# EAGLE board upperArm (EAGLE 9.6.2)
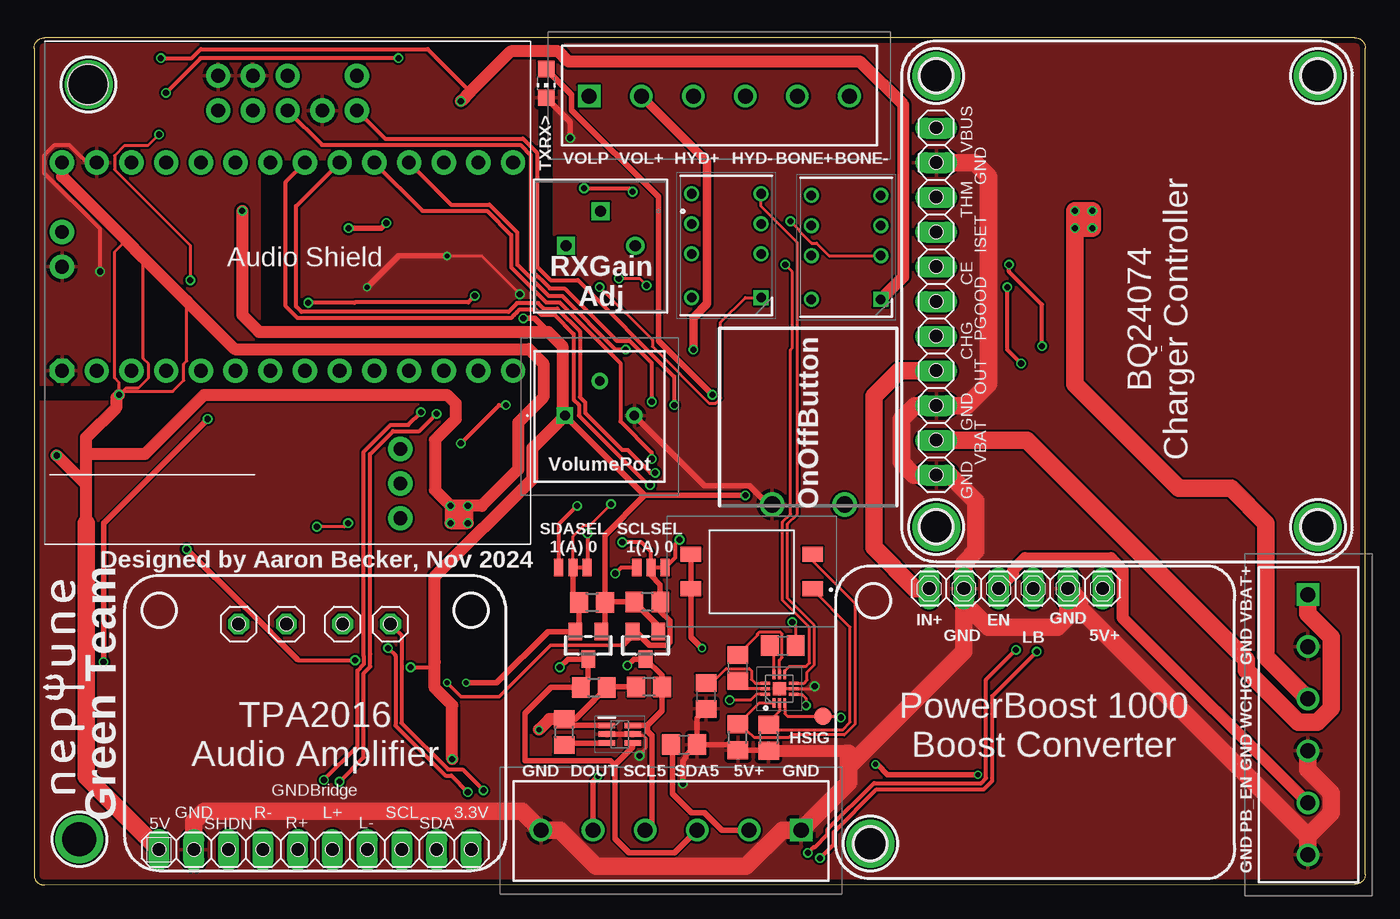
[diagram p5: board, top side]
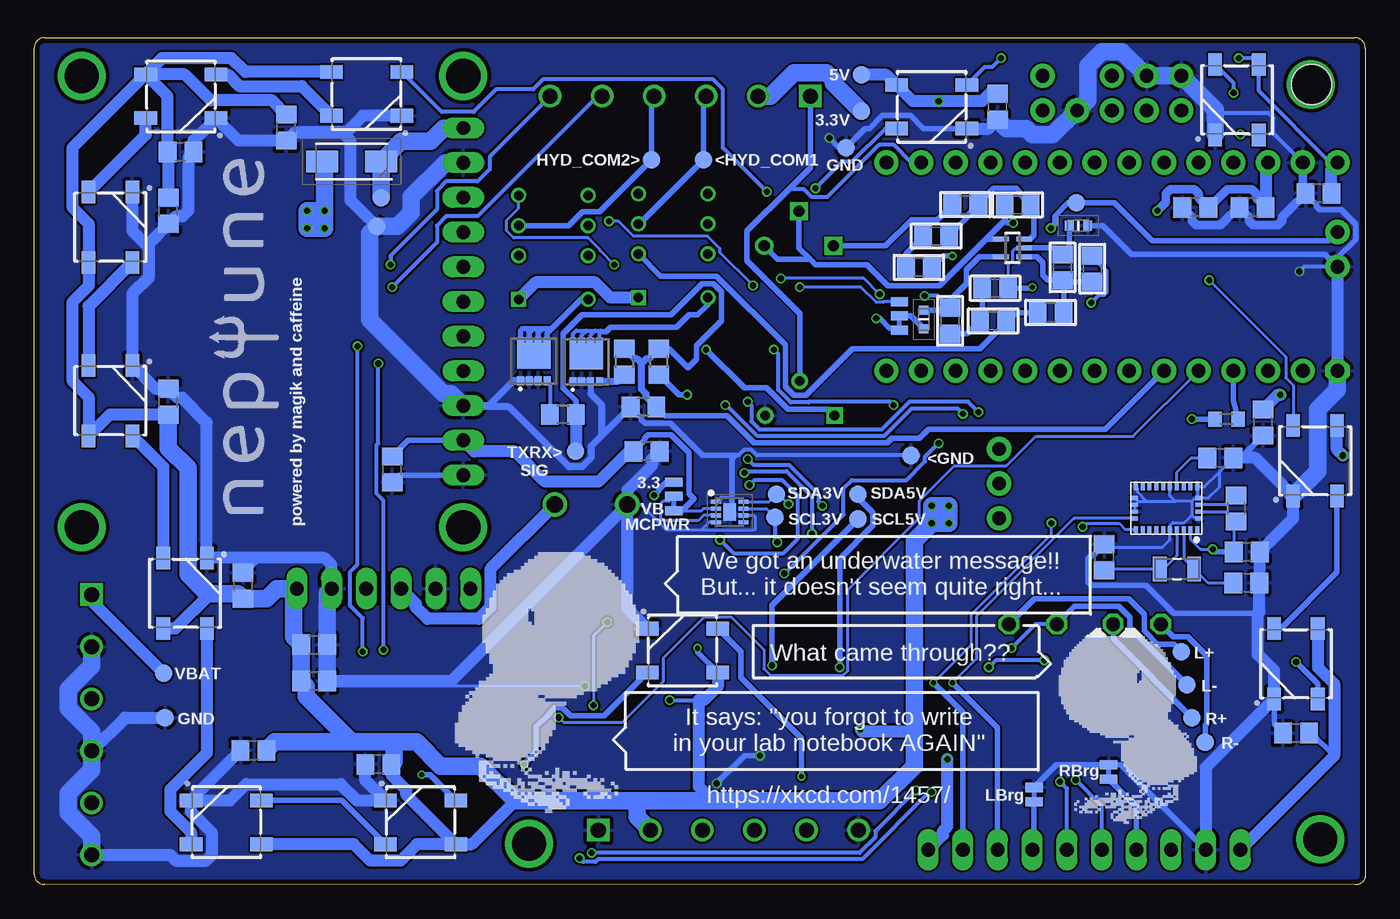
[diagram p6: board, bottom side, seen from below]

Size 97.46 x 62 mm. Coordinates in mm from the lower left corner, seen from the top.
Outline: 0.76,0 96.7,0.03 arc90 97.46,0.79 97.46,61.24 arc90 96.7,62 0.76,62 arc90 0,61.24 0,0.66 arc90 0.76,0
Copper layers (1*16): Top 0.035559375mm / dielectric 1.6mm / Bottom 0.035559375mm
Design rules "oshpark-2layer *": minimum track width 6mil, minimum drill 10mil, track to track 6mil, track to pad 6mil, pad to pad 6mil, via to via 6mil, smd to smd 6mil, copper to edge 15mil, drill to drill 6mil, minimum pad ring 5mil, minimum via ring 5mil, stop-mask expansion 2.5mil, vias tented up to drill 20mil, thermal gap 10mil
Net classes: 0 default: width 0.203 mm; 2 ICPower: width 0.203 mm

## Footprints (pad centres in the part's own frame; a part is rotated, then mirrored left to right if it is on the bottom)
B1,27 = smd 1.27 x 1.27: TP 0,0
C0805 = smd 1.3 x 1.5: 1 -0.95,0; 2 0.95,0
0805 = smd 1.3 x 1.5: 1 -0.95,0; 2 0.95,0
WS2812-5X5-4PIN = smd 1.651 x 1: DI 2.577,1.6; DO -2.577,-1.6; GND 2.577,-1.6; VCC -2.577,1.6
DIOM5226X244N = smd 2.35 x 1.55: 1 -2.15,0; 2 2.15,0
BLM18SP221SN1B = smd 0.65 x 0.7: 1 -0.675,0; 2 0.675,0
SOT65P210X100-6N = smd 1.2 x 0.4: 1 -0.95,0.65; 2 -0.95,0; 3 -0.95,-0.65; 4 0.95,-0.65; 5 0.95,0; 6 0.95,0.65
SON50P200X200X80-9N = smd 0.75 x 0.3: 1 -1,0.75; 2 -1,0.25; 3 -1,-0.25; 4 -1,-0.75; 5 1,-0.75; 6 1,-0.25; 7 1,0.25; 8 1,0.75 | smd 0.9 x 1.3: 9 0,0
QFN40P200X200X80-13N = smd 0.7 x 0.2: 1 -1.05,0.4; 2 -1.05,0; 3 -1.05,-0.4; 7 1.05,-0.4; 8 1.05,0; 9 1.05,0.4 | smd 0.2 x 0.7: 4 -0.4,-1.05; 5 0,-1.05; 6 0.4,-1.05; 10 0.4,1.05; 11 0,1.05; 12 -0.4,1.05 | smd 0.95 x 0.95: 13 0,0
DS04254202BKSMT = smd 1.1 x 1.5: 1 -1.27,-4.45; 2 1.27,-4.45; 3 1.27,4.45; 4 -1.27,4.45
1727052 = drill 1.1 pad 1.65 square: 1 0,0 | drill 1.1 pad 1.65: 2 3.81,0; 3 7.62,0; 4 11.43,0; 5 15.24,0; 6 19.05,0
1X11 = drill 1.016 long: 1 -12.7,0; 2 -10.16,0; 3 -7.62,0; 4 -5.08,0; 5 -2.54,0; 6 0,0; 7 2.54,0; 8 5.08,0; 9 7.62,0; 10 10.16,0; 11 12.7,0
SMT-JUMPER_3_1-NC_TRACE_NO-SILK = smd 0.66 x 1.27: 1 -1.041,0; 2 0,0; 3 1.041,0
1X06 = drill 1.016 long: 1 -6.35,0; 2 -3.81,0; 3 -1.27,0; 4 1.27,0; 5 3.81,0; 6 6.35,0
SMT-JUMPER_2_NC_TRACE_NO-SILK = smd 0.66 x 1.27: 1 -0.521,0; 2 0.521,0
1X01 = drill 1.016 octagon: 1 0,0
G6K2PYDC12 = drill 0.7 pad 1.1 square: 1 0,0 | drill 0.7 pad 1.1: 2 0,-3.2; 3 0,-5.4; 4 0,-7.6; 5 5.08,-7.6; 6 5.08,-5.4; 7 5.08,-3.2; 8 5.08,0
CHIP-LED0805 = smd 1.2 x 1.2: A 0,-1.05; C 0,1.05
CSD16327 = smd 0.5 x 0.63: 1 -0.975,-1.435; 2 -0.325,-1.435; 3 0.325,-1.435; 4 0.975,-1.435 | smd 0.5 x 0.41: 5 0.975,1.545; 6 0.325,1.545; 7 -0.325,1.545; 8 -0.975,1.545 | smd 2.45 x 1.9: 9 0,0.39
SOT23-WIDE = smd 1 x 1.27: 1 -0.95,-1; 2 0.95,-1; 3 0,1
R0805 = smd 1.3 x 1.5: 1 -0.95,0; 2 0.95,0
POT_3386P = drill 0.813 pad 1.321: 1 0,0 | drill 0.813 pad 1.321 square: 2 2.54,-2.54; 3 5.08,0
R0603 = smd 1 x 1.1: 1 -0.85,0; 2 0.85,0
GPTS203211B = drill 1.2 pad 1.8: 1 -0.081,-2.65; 2 -0.081,2.65
SC70-5 = smd 0.35 x 1.15: 1 -0.65,-0.85; 2 0,-0.85; 3 0.65,-0.85; 4 0.65,0.85; 5 -0.65,0.85
LGA28R50P4X10_380X520X100 = smd 0.3 x 0.525: 1 -2.25,1.562; 6 -2.25,-1.562; 7 -1.75,-1.562; 8 -1.25,-1.562; 9 -0.75,-1.562; 10 -0.25,-1.562; 11 0.25,-1.562; 12 0.75,-1.562; 13 1.25,-1.562; 14 1.75,-1.562; 15 2.25,-1.562; 20 2.25,1.562; 21 1.75,1.562; 22 1.25,1.562; 23 0.75,1.562; 24 0.25,1.562; 25 -0.25,1.562; 26 -0.75,1.562; 27 -1.25,1.562; 28 -1.75,1.562 | smd 0.425 x 0.3: 2 -2.312,0.75; 3 -2.312,0.25; 4 -2.312,-0.25; 5 -2.312,-0.75; 16 2.312,-0.75; 17 2.312,-0.25; 18 2.312,0.25; 19 2.312,0.75
AUDIOSHIELD = drill 1 pad 1.778: 0 -13.97,-5.08; 1 -11.43,-5.08; 2 -8.89,-5.08; 3 -6.35,-5.08; 3V -11.43,10.16; 4 -3.81,-5.08; 5 -1.27,-5.08; 5V -16.51,10.16; 6 1.27,-5.08; 7 3.81,-5.08; 8 6.35,-5.08; 9 8.89,-5.08; 10 11.43,-5.08; 11 13.97,-5.08; 12 16.51,-5.08; 13 16.51,10.16; 14 13.97,10.16; 15 11.43,10.16; 16 8.89,10.16; 17 6.35,10.16; 18 3.81,10.16; 19 1.27,10.16; 20 -1.27,10.16; 21 -3.81,10.16; 22 -6.35,10.16; 23 -8.89,10.16; G -13.97,10.16; GND_MIC -16.51,2.54; INGND1 -5.08,16.51; INGND2 -2.54,16.51; INL -5.08,13.97; INR -2.54,13.97; MIC -16.51,5.08; OUTGND 2.54,13.97; OUTL 5.08,13.97; OUTR 0,13.97; UNUSED1 0,16.51; UNUSED2 5.08,16.51; VOL 8.255,-13.335; VOL_3.3V 8.255,-15.875; VOL_GND 8.255,-10.795 | drill 1 pad 1.778 octagon: GND -16.51,-5.08 | hole 2.921: -14.605,15.875
1X10 = drill 1.016 long: 1 -11.43,0; 2 -8.89,0; 3 -6.35,0; 4 -3.81,0; 5 -1.27,0; 6 1.27,0; 7 3.81,0; 8 6.35,0; 9 8.89,0; 10 11.43,0
MOUNTINGHOLE_2.5_PLATED = drill 2.5 pad 3.2: P$1 0,0
3310P125103L = drill 0.71 pad 1.217 square: 1 0,0 | drill 0.71 pad 1.217: 2 2.54,2.54; 3 5.08,0
NDK_NX3215SA-32.768K-STD-MUA-8_0 = smd 1 x 1.8: 1 -1.25,0; 2 1.25,0

## Placement (x,y rotation side)
3V  TPB1,27  [B1,27]  36.88,56.62 0 bottom
5V  TPB1,27  [B1,27]  36.88,59.29 0 bottom
5VG  TPB1,27  [B1,27]  38.02,53.95 0 bottom
BQ_USB_VBUS  TPB1,27  [B1,27]  72.06,50.27 0 bottom
C1  1uF  [C0805]  52.63,31.73 0 bottom
C2  10uF  [C0805]  49.2,13.82 270 top
C3  10uF  [C0805]  47.57,10.26 0 top
C4  1uF  [C0805]  54.81,17.5 0 top
C5  0.1uF  [C0805]  8.69,24.36 0 bottom
C6  1uF  [C0805]  51.51,15.88 90 top
C7  0.1µF  [0805]  27.1,43.66 0 bottom
C8  0.01uF  [0805]  23.04,41.89 0 bottom
C9  100pF  [0805]  25.45,49.76 0 bottom
C10  10uF  [0805]  32.69,45.19 0 bottom
C11  0.1uF  [C0805]  71.25,30.41 270 bottom
C12  1uF  [C0805]  72.26,8.82 0 bottom
C13  1uF  [C0805]  81.41,9.83 0 bottom
C14  1uF  [C0805]  82.17,21.9 270 bottom
C15  1uF  [C0805]  87.63,35.36 270 bottom
C16  9pF  [C0805]  8.71,22.1 180 bottom
C17  9pF  [C0805]  19.13,23.98 270 bottom
C18  1uF  [C0805]  87.63,49.33 90 bottom
C19  1uF  [C0805]  86.74,53.65 180 bottom
C20  1uF  [C0805]  78.99,55.42 90 bottom
C21  0.1uF  [C0805]  10.62,31.24 180 bottom
C22  1uF  [C0805]  26.92,56.95 90 bottom
C23  1uF  [C0805]  3.43,50.6 0 bottom
C24  1uF  [C0805]  7.49,33.83 90 bottom
C25  1uF  [C0805]  76.96,17.58 180 bottom
C26  1uF  [C0805]  5.08,11.1 0 bottom
C27  10uF  [C0805]  76.96,14.91 180 bottom
C28  1uF  [C0805]  8.26,49.58 0 bottom
C29  10uF  [C0805]  12.45,49.58 0 bottom
D1  WS2812_5050  [WS2812-5X5-4PIN]  3.68,31.04 270 bottom
D2  WS2812_5050  [WS2812-5X5-4PIN]  9.4,57.46 270 bottom
D3  WS2812_5050  [WS2812-5X5-4PIN]  31.75,56.95 0 bottom
D4  WS2812_5050  [WS2812-5X5-4PIN]  73.13,57.89 0 bottom
D5  WS2812_5050  [WS2812-5X5-4PIN]  86.72,57.71 0 bottom
D6  WS2812_5050  [WS2812-5X5-4PIN]  91.87,35.43 90 bottom
D7  WS2812_5050  [WS2812-5X5-4PIN]  86.41,21.34 90 bottom
D8  WS2812_5050  [WS2812-5X5-4PIN]  91.87,48.13 90 bottom
D9  WS2812_5050  [WS2812-5X5-4PIN]  83.39,4.57 180 bottom
D10  WS2812_5050  [WS2812-5X5-4PIN]  69.16,4.57 180 bottom
D11  WS2812_5050  [WS2812-5X5-4PIN]  49.99,17.15 180 bottom
D12  SK34AQ-LTP  [DIOM5226X244N]  74.22,52.94 180 bottom
D13  WS2812_5050  [WS2812-5X5-4PIN]  5.08,16.18 270 bottom
FB2  BLM18PG471SN1D  [BLM18SP221SN1B]  21.01,48.24 0 bottom
FB3  BLM18PG471SN1D  [BLM18SP221SN1B]  32.33,41.38 270 bottom
HYD_COM1  TPB1,27  [B1,27]  48.44,53.06 0 bottom
HYD_COM2  TPB1,27  [B1,27]  52.25,53.06 0 bottom
HYD_RX_AMP  TPB1,27  [B1,27]  21.16,49.91 180 bottom
HYD_TX_SIG  TPB1,27  [B1,27]  57.73,12.32 90 top
IC1  LTC4311CSC6#TRPBF  [SOT65P210X100-6N]  42.88,11.03 0 top
IC2  MAX17048G+T10  [SON50P200X200X80-9N]  46.53,27.28 0 bottom
IC3  PAM8904EGPR  [QFN40P200X200X80-13N]  54.56,14.35 90 top
IC4  DS04-254-2-02BK-SMT  [DS04254202BKSMT]  52.53,22.93 90 top
J2  1727052  [1727052]  40.64,57.72 0 top
J3  1727052  [1727052]  56.16,4 180 top
J4  1727052  [1727052]  93.25,21.24 270 top
JP1  [1X11]  66.04,42.69 270 top
JP2  JUMPER-SMT_3_1-NC_TRACE_NO-SILK  [SMT-JUMPER_3_1-NC_TRACE_NO-SILK]  39.45,23.22 0 top
JP3  JUMPER-SMT_3_1-NC_TRACE_NO-SILK  [SMT-JUMPER_3_1-NC_TRACE_NO-SILK]  45.16,23.22 0 top
JP4  [1X06]  71.88,21.68 180 top
JP5  JUMPER-SMT_2_NC_TRACE_NO-SILK  [SMT-JUMPER_2_NC_TRACE_NO-SILK]  18.8,8.25 270 bottom
JP6  JUMPER-SMT_2_NC_TRACE_NO-SILK  [SMT-JUMPER_2_NC_TRACE_NO-SILK]  24.26,6.6 270 bottom
JP7  [1X01]  26.09,19.08 90 top
JP8  JUMPER-SMT_3_1-NC_TRACE_NO-SILK  [SMT-JUMPER_3_1-NC_TRACE_NO-SILK]  50.62,28.42 270 bottom
JP11  [1X01]  22.58,19.08 90 top
JP12  [1X01]  14.97,19.08 90 top
JP13  [1X01]  18.47,19.08 90 top
JP14  JUMPER-SMT_3_1-NC_TRACE_NO-SILK  [SMT-JUMPER_3_1-NC_TRACE_NO-SILK]  34.11,41.63 270 bottom
K1  G6K-2P-Y-DC5  [G6K2PYDC12]  53.22,42.98 180 top
K2  G6K-2P-Y-DC5  [G6K2PYDC12]  61.98,42.85 180 top
LED2  RED  [CHIP-LED0805]  37.49,58.66 180 top
Q1  CSD17575Q3  [CSD16327]  57.05,38.28 0 bottom
Q2  CSD17575Q3  [CSD16327]  60.88,38.33 0 bottom
Q3  BSS138  [SOT23-WIDE]  40.56,17.53 180 top
Q4  BSS138  [SOT23-WIDE]  44.75,17.53 180 top
R1  10k  [R0805]  38.81,11.18 90 top
R2  10k  [R0805]  40.84,20.68 0 top
R3  10k  [R0805]  44.88,20.7 180 top
R4  10k  [R0805]  51.51,10.8 90 top
R5  10k  [R0805]  53.77,10.77 270 top
R6  1K  [0805]  27.25,41.28 180 bottom
R7  1K  [0805]  30.4,41.28 90 bottom
R8  1K  [0805]  31.42,47.47 0 bottom
R9  1M  [0805]  22.17,45.19 270 bottom
R10  1M  [0805]  19.99,45.09 90 bottom
R11  22K  [0805]  29.29,49.79 180 bottom
R12  3386P-1-104LF  [POT_3386P]  44.01,46.76 180 top
R13  100  [R0603]  10.16,34.09 180 bottom
R14  220  [R0805]  58.75,34.42 180 bottom
R17  10k  [R0805]  40.97,14.45 0 top
R18  10k  [R0805]  45.01,14.48 180 top
R23  220  [R0805]  54.25,38.28 270 bottom
R27  100k  [R0805]  52.86,34.98 180 bottom
R29  100  [R0805]  51.71,38.28 90 bottom
R32  10k  [R0805]  9.47,27.54 270 bottom
S1  GPTS203211B  [GPTS203211B]  56.68,27.74 270 top
SCL_3V  TPB1,27  [B1,27]  43.23,26.9 0 bottom
SCL_5V  TPB1,27  [B1,27]  37.13,26.77 0 bottom
SCLG  TPB1,27  [B1,27]  33.27,31.42 180 bottom
SDA_3V  TPB1,27  [B1,27]  43.13,28.58 180 bottom
SDA_5V  TPB1,27  [B1,27]  37.16,28.58 180 bottom
SDAG  TPB1,27  [B1,27]  72.39,48.19 0 bottom
TP_TXRX  TPB1,27  [B1,27]  57.84,31.73 0 bottom
TPA_L+  TPB1,27  [B1,27]  13.46,17.07 270 bottom
TPA_L-  TPB1,27  [B1,27]  13.08,14.66 270 bottom
TPA_R+  TPB1,27  [B1,27]  11.73,10.44 270 bottom
TPA_R-  TPB1,27  [B1,27]  12.7,12.24 270 bottom
U1  MAX4466EXK+T  [SC70-5]  25.83,46.61 90 bottom
U8  BNO055  [LGA28R50P4X10_380X520X100]  14.55,27.56 180 bottom
U$1  [AUDIOSHIELD]  18.55,42.7 0 top
U$7  [1X10]  20.57,2.57 0 top
U$11  MOUNTINGHOLE2.5  [MOUNTINGHOLE_2.5_PLATED]  93.98,59.2 270 top
U$14  MOUNTINGHOLE2.5  [MOUNTINGHOLE_2.5_PLATED]  66.04,59.2 270 top
U$15  MOUNTINGHOLE2.5  [MOUNTINGHOLE_2.5_PLATED]  61.23,3.01 0 top
U$16  MOUNTINGHOLE2.5  [MOUNTINGHOLE_2.5_PLATED]  66.04,26.18 270 top
U$17  MOUNTINGHOLE2.5  [MOUNTINGHOLE_2.5_PLATED]  93.98,26.18 270 top
U$18  MOUNTINGHOLE2.5  [MOUNTINGHOLE_2.5_PLATED]  3.99,58.57 0 top
U$19  MOUNTINGHOLE2.5  [MOUNTINGHOLE_2.5_PLATED]  3.31,3.34 0 top
VBAT  TPB1,27  [B1,27]  87.96,15.47 0 bottom
VBAT1  TPB1,27  [B1,27]  87.88,12.24 0 bottom
VR1  3310P-125-103L  [3310P125103L]  38.86,34.34 0 top
Y1  NDK_NX3215SA-32.768K-STD-MUA-9  [NDK_NX3215SA-32.768K-STD-MUA-8_0]  13.79,23.12 180 bottom

## Tracks (layer width: path | path; a pad name or v marks a point on that pad's centre or on a via)
3.3V  (via drill 0.45)
  Top 0.305: 19.26,16.52 19.34,16.44 v23.5,16.44 | v27.56,15.93 28.95,15.93 29.33,16.31
  Top 0.406: Q3.1 41.79,18.81 R2.2 | R2.2 41.82,20.7 R3.2 44.83,19.81 45.7,18.93 Q4.1 | v52.07,28.5 44.7,28.5 | 44.7,28.5 VR1.1 | 44.7,28.5 41.79,25.59 R2.2 | 37.88,40.22 36.65,41.45 v35.81,41.45 | v11.18,24.56 15.44,20.3 15.47,20.3 19.26,16.52
  Top 0.635: v48.26,39.17 48.26,41.51 49.26,42.51 49.26,52.91 J2.2
  Top 0.889: v15.24,49.33 15.24,41.71 16.47,40.48 37.63,40.48 37.88,40.22 38.68,39.42 38.68,34.52 VR1.1 36.47,31.95 36.47,29.72 29.33,22.57 29.33,16.31 29.33,14.41 30.61,13.13 v30.61,9.2
  Bottom 0.203: U8.3 10.2,27.31 R32.2 9.64,26.42 C5.1 | U8.28 12.8,25.3 12.06,24.56 v11.18,24.56
  Bottom 0.305: v23.5,16.44 27.05,16.44 v27.56,15.93
  Bottom 0.406: v52.07,28.5 51.71,28.86 51.71,28.94 51.19,29.47 JP8.1 | C5.1 10.97,24.36 v11.18,24.56 | JP14.3 34.26,40.74 34.83,40.74 35.55,41.45 v35.81,41.45 | v48.26,39.17 45.47,36.37 43.84,36.37 42.26,34.8 39.32,34.8 VR1.1
  Bottom 0.635: C28.2 7.98,50.26 7.98,50.57 8.32,50.9 10.09,50.9 11.41,49.58 C29.2 12.18,50.26 12.18,50.57 12.51,50.9 14.28,50.9 14.62,50.57 14.62,49.95 v15.24,49.33
  Bottom 0.889: U$1.3V 7.3,52.68 C28.2 | U$7.10 30.92,3.65 30.92,3.94 30.61,4.26 v30.61,9.2
  Bottom 1.27: 3V.TP 38.93,58.66 38.93,58.91 39.45,59.43 41.83,59.43 43.55,57.72 J2.2
3.3VI2C_SCL0  (via drill 0.45)
  Top 0.305: v45.09,29.26 44.96,29.26 39.88,34.34 39.88,35.12 39.5,35.5 39.5,40.31 38.1,41.71 37.11,41.71 36.71,42.11 35.54,42.11 35.35,41.92 35.14,41.71 34.91,41.48 19.27,41.48 18.41,42.34 18.41,51.45 U$1.19 | JP3.3 46.93,23.94 46.93,24.92 47.24,25.23 v47.24,25.25
  Bottom 0.305: v45.09,29.26 44.7,29.64 42.72,29.64 41.58,28.5 41.58,25.3 42.6,24.28 46.27,24.28 v47.24,25.25
3.3VI2C_SCL1  (via drill 0.45)
  Top 0.305: U$1.16 30.52,49.79 33.34,49.79 35.38,47.74 35.38,45.38 37.68,43.08 38.67,43.08 42.58,39.17 v43.31,39.17 | JP3.1 42.98,23.22 v42.55,22.79 | v31.24,32.31 34.04,35.1 v34.54,35.1
  Bottom 0.305: v31.24,32.31 32.23,31.32 32.23,30.99 33.6,29.62 37.59,29.62 38.2,29.01 38.2,27.09 42.51,22.79 v42.55,22.79 | v34.54,35.1 34.8,35.36 40.7,35.36 40.75,35.31 42.05,35.31 42.98,36.23 42.98,38.84 v43.31,39.17
3.3VI2C_SDA0  (via drill 0.45)
  Top 0.305: v45.47,30.15 45.12,30.15 43.45,31.82 43.04,31.82 40.33,34.53 40.33,35.31 39.95,35.69 39.95,40.5 38.29,42.17 37.3,42.17 36.9,42.57 35.35,42.57 34.73,41.94 19.58,41.94 19.18,42.34 19.18,49.67 U$1.18 | v40.51,25.71 40.51,23.24 JP2.3
  Bottom 0.305: v45.47,30.15 45.34,30.28 42.38,30.28 40.51,28.41 v40.51,25.71
3.3VI2C_SDA1  (via drill 0.45)
  Top 0.305: U$1.17 28.43,49.33 33.15,49.33 34.92,47.55 34.92,45.19 37.49,42.62 38.48,42.62 42.93,38.17 42.93,33.92 45.21,31.64 v45.21,31.17 | v39.75,27.74 38.41,26.39 JP2.1
  Bottom 0.305: v45.21,31.17 44.78,30.74 42.19,30.74 40.06,28.6 40.06,28.04 v39.75,27.74
5V  (via drill 0.35, 0.45)
  Top 0.203: IC3.12 52.89,13.95 52.45,13.51 v50.93,13.51 | v6.22,35.87 6.22,36.76 5.88,37.1 5.88,46.32 6.72,47.16 | v6.22,35.87 6.73,36.37 7.64,36.37 8.37,37.1 8.37,38.13 8,38.51 8,45.89 | v6.22,35.87 6.48,36.12 10.16,36.12 10.96,36.92 10.96,38.13 11.17,38.34 11.17,42.72 | v41.4,43.74 45.26,39.88 45.26,39.4 49.41,35.26 49.91,35.26 50.26,35.62 50.26,41.17 52.07,42.98 K1.1
  Top 0.305: v9.27,60.5 11.54,60.5 12.2,61.16 28.81,61.16 31.93,58.04
  Top 0.406: R18.2 41.95,14.48 R17.2 41.03,13.56 39.6,12.13 R1.2 39.26,11.68 IC1.1 | v48.9,17.32 48.08,18.14 IC4.4 IC4.3 | C3.1 46.74,10.15 46.74,6.66 48.11,5.28 49.07,5.28 50.35,4 J3.2
  Top 0.889: R1.2 37.73,12.13 v36.96,11.36 | U$1.5V 2.04,51.84 6.72,47.16 8,45.89 11.17,42.72 14.68,39.21 36.23,39.21 37.29,38.15 37.29,35.69 35.43,33.83 35.43,30.41 32.77,27.74 v31.75,27.74 | 3.81,26.47 3.81,29.26 | 3.81,29.26 v1.65,31.42 | v6.22,35.87 6.03,35.67 6.03,34.97 3.81,32.75 3.81,31.55 | 3.81,29.26 3.81,31.55 | v31.75,27.74 v30.48,27.74 | v30.48,27.74 v30.48,26.47 | v30.48,26.47 v31.75,26.47 v31.75,27.74 | v30.48,26.47 v31.75,27.74 | K2.1 63.63,44.5 63.63,57.08 60.45,60.25 39.13,60.25 38.38,61.01 34.9,61.01 31.93,58.04 v31.24,57.35 | 3.81,31.55 8.13,31.55 12.45,35.87 30.23,35.87 30.86,35.23 30.86,34.09 29.34,32.56 29.34,28.88 v30.48,27.74
  Top 1.27: U$7.1 3.81,7.91 3.81,26.47
  Bottom 0.203: JP14.1 35.26,42.67 35.31,42.62 35.81,42.62 36.93,43.74 v41.4,43.74
  Bottom 0.305: U$1.5V 2.55,52.86 7.8,58.1 D2.VCC 8.27,60.5 v9.27,60.5 | v50.93,13.51 48.81,13.51 48.43,13.51
  Bottom 0.406: D11.VCC 48.9,17.03 v48.9,17.32 | C26.2 3.95,11.1 2.28,9.44
  Bottom 0.889: D4.VCC 82,59.49 83.02,60.51 88.09,60.51 D5.VCC | D5.VCC 94.67,53.93 94.67,49.6 93.47,48.4 D8.VCC 93.47,43.83 94.67,42.63 94.67,36.9 93.47,35.7 D6.VCC 91.92,34.41 C15.2 | D10.VCC 65.41,2.97 62.23,6.15 | D7.VCC 87.12,18.76 84.58,21.31 83.82,21.31 | D10.VCC 69.43,2.97 70.63,1.78 72.86,1.78 74.06,2.97 D9.VCC | 48.81,13.51 48.81,7.2 47.75,6.15 | v36.96,11.36 36.83,11.23 33.02,11.23 | D13.VCC 3.48,15.92 2.28,14.72 2.28,9.44 U$7.1 | D10.VCC 70.22,6.6 70.22,6.96 71.31,8.06 C12.2 | C20.2 80.03,57.41 84.55,57.41 86.45,59.31 D5.VCC | D5.VCC 87.69,57.71 C19.2 87.63,53.59 C18.2 | 5V.TP 35.06,59.29 D3.VCC 33.13,57.35 v31.24,57.35 28.06,57.35 27.51,57.9 C22.2 | C23.2 2.48,52.42 U$1.5V | K1.1 55.26,42.98 56.39,44.1 60.73,44.1 K2.1 | v1.65,31.42 2.08,31.85 D1.VCC | v6.22,35.87 6.41,35.87 C24.2 | D11.VCC 47.41,14.53 48.43,13.51
  Bottom 1.27: 53.34,6.15 62.23,6.15 64.77,8.69 67.7,8.69 69.47,10.45 71.12,10.45 | 53.34,6.15 47.75,6.15 35.56,6.15 33.02,8.69 33.02,11.23 33.02,25.2 v31.75,26.47 | 53.34,6.15 53.34,4.99 J3.2 | 74.21,10.45 77.55,13.79 77.55,14.55 C27.2 C25.2 78.48,18.15 78.48,21.43 JP4.1 79.72,21.68 80.45,20.95 C14.2 82.53,21.31 83.82,21.31 84.79,21.31 86.2,22.72 86.2,30.53 87.63,31.96 C15.2 | 71.12,10.45 74.21,10.45 | C12.2 71.12,9.01 71.12,10.45 | 74.21,10.45 79.83,10.45 C13.2 | v31.75,26.47 v30.48,26.47 v30.48,27.74 v31.75,27.74 v31.75,26.47
AGND  (via drill 0.35, 0.45)
  Top 0.203: v30.23,46.03 32.76,46.03 v35.56,43.23 | v42.8,44.38 44.32,44.38 v44.83,43.87 | v55.37,48.57 56,47.94 56,47.88 56.92,46.96 57.28,46.96 58.18,46.05 K2.2
  Top 0.406: v24.38,43.74 26.67,46.03 v30.23,46.03
  Bottom 0.203: U1.2 25.06,46.53 25.65,46.53 25.85,46.34 25.85,45.68 26.15,45.38 C7.2 | 31.58,45.35 C10.2 | v35.56,43.23 36.71,44.38 v42.8,44.38 | v44.83,43.87 47.23,46.27 47.23,46.55 48.15,47.47 53.59,47.47 54.69,48.57 v55.37,48.57
  Bottom 0.305: 22.65,46.61 R9.1
  Bottom 0.406: U1.2 22.65,46.61 | v30.23,46.03 30.9,46.03 31.58,45.35 | R9.1 21.68,46.63 FB2.1 | C7.2 24.46,43.66 v24.38,43.74
  pour Top: 36.83,39.17 17.78,39.17 17.78,51.87 36.83,51.87
AVCC  (via drill 0.45)
  Top 0.305: v32.26,43.11 31.77,42.62 23.48,42.62 23.46,42.6 v20.07,42.6
  Bottom 0.305: R7.2 31.28,43.11 v32.26,43.11 | R10.2 19.99,45.97 18.93,44.91 18.93,43.36 19.11,43.18 19.48,43.18 v20.07,42.6
  Bottom 0.406: U1.5 28.26,45.96 29.21,45.01 29.21,43.99 30.4,42.8 R7.2 30.58,42.05 FB3.1
BONECOND_+  (via drill 0.45)
  Top 0.305: JP7.1 26.9,18.27 26.9,11.84 30.3,8.45 31.36,8.45 v32.89,6.91 | v71.88,17.2 69.69,15.01 69.69,7.8 69.34,7.45 61.48,7.45 58.09,4.05 58.09,3.7 57.15,2.77 57.07,2.77 v56.64,2.34 | v72.26,38.15 71.25,39.17 v71.25,43.74
  Bottom 0.305: v71.25,43.74 67.97,47.02 67.97,48.25 67.29,48.93 65,48.93 56.21,57.72 J2.5 | v32.89,6.91 35.88,3.93 35.88,3.49 37.03,2.34 v56.64,2.34 | v71.88,17.2 71.88,28.12 72.4,28.64 72.4,32.17 72.26,32.31 v72.26,38.15
  Bottom 0.406: TPA_L+.TP 13.99,17.6 15.21,17.6 16.19,18.58 16.19,19.79 17.32,20.93 24.24,20.93 JP7.1
BONECOND_-  (via drill 0.45)
  Top 0.305: v25.91,17.32 26.45,16.79 26.45,11.65 30.11,7.99 30.54,7.99 v31.75,6.78 | v73.41,17.07 70.15,13.82 70.15,7.61 69.53,6.99 61.67,6.99 58.55,3.86 58.55,2.97 v57.53,1.96 | v73.79,39.42 73.79,42.47 71.37,44.88 v71.37,45.39
  Bottom 0.305: v71.37,45.39 71.37,46.03 67.97,49.44 67.97,50.79 67.29,51.47 65,51.47 64.11,52.36 64.11,53.3 J2.6 | JP11.1 24.15,19.08 v25.91,17.32 | v31.75,6.78 31.93,6.78 36.84,1.88 56.17,1.88 56.37,1.68 57.26,1.68 v57.53,1.96 | v73.41,17.07 73.41,19.53 74.31,20.43 74.31,22.93 73.79,23.45 v73.79,39.42
  Bottom 0.406: TPA_L-.TP 17.25,18.82 17.25,19.59 18.03,20.37 21.29,20.37 JP11.1
BQ_LOAD_OUT
  Top 1.27: JP1.8 63.34,37.61 61.47,35.74 61.47,24.69 64.48,21.68 JP4.6
BQ_USB_VBUS
  Bottom 1.27: JP1.1 67.47,55.39 68.45,54.41 70.6,54.41 D12.1 BQ_USB_VBUS.TP
GND  (via drill 0.45)
  Top 0.203: IC1.5 43.92,10.93 44.57,10.93 44.78,10.72 44.78,10.03 44.32,9.57 v44.32,9.45 | v57.15,14.53 56.97,14.35 IC3.5 IC3.13
  Top 0.305: v4.83,44.88 4.83,48 0.75,52.08 0.75,53.4 1.51,54.15 2.58,54.15 3.88,52.86 U$1.G
  Top 0.406: IC1.2 IC1.5 | C2.2 48.52,12.19 C3.2 | C3.2 51.09,10.26 R4.1 53.75,9.85 R5.2 | S1.1 53.75,27.82 52.36,29.21 49.08,29.21 VR1.3 | LED2.C 39.24,55.85 v39.24,54.66 | v47.5,7.42 47.5,9.09 47.73,9.32 47.73,9.47 C3.2
  Top 0.889: R5.2 59.44,9.82 59.62,9.65
  Top 1.27: JP4.5 68.07,20.63 69.85,18.85 74.93,18.85 75.69,19.6 JP4.2 76.58,20.79 76.58,20.23 93.25,3.56 J4.6 93.25,3.57 94.96,5.29 94.96,6.71 93.25,8.42 J4.4 | U$7.2 11.68,4.62 12.45,5.39 35.72,5.39 J3.6 38.49,4 41.14,1.35 52.12,1.35 54.77,4 J3.1 59.62,7.46 59.62,8.63 | JP4.5 68.07,23.54 68.96,24.44 68.96,28.08 67.06,29.99 JP1.11 64.43,29.99 63.5,30.91 63.5,34.09 64.48,35.07 JP1.9 68.29,35.07 69.85,36.63 69.85,51.87 68.87,52.85 JP1.2 | 59.62,9.65 59.62,8.63 | JP4.5 68.07,17.08 59.62,8.63
  Bottom 0.203: U8.5 12.3,28.37 U8.6 11.79,29.12 10.67,30.24 | 12.71,28.07 12.56,28.21 12.34,28.21 U8.5 | 12.71,27.06 12.56,26.91 12.34,26.91 U8.2 | 12.71,28.07 12.71,27.06 | U8.10 14.34,29.09 14.34,28.5 13.9,28.07 | 12.71,28.07 13.9,28.07 | U8.15 16.71,29.03 16.71,28.76 16.02,28.07 | 16.02,28.07 13.9,28.07 | U8.16 16.62,28.07 | 16.62,28.07 16.02,28.07 | 16.62,28.07 16.62,28.06 U8.17 U8.18 | 12.71,27.06 13.25,26.51 14.06,26.51 14.3,26.27 U8.25 14.3,25.25 14.86,24.69 18.89,24.69 C17.1 | IC2.6 44.76,27.03 44.7,26.98 44.7,25.96 48.64,25.96 | 48.64,25.96 51.18,25.96 53.04,27.82 S1.1 | U8.5 11.49,28.31 10.67,29.14 10.67,30.24 | 10.67,30.24 10.56,30.35 C21.1 | v57.15,14.53 75.63,14.53 C27.1 | 48.64,25.96 48.07,26.53 IC2.4 | IC2.1 47.19,28.37 46.37,28.37
  Bottom 0.305: U$1.G 6.73,55 6.73,56.12 7.08,56.48 11,56.48 | U$1.GND_MIC 4.47,45.24 v4.83,44.88 | SCLG.TP 44.54,31.42 44.94,31.82 45.48,31.82 45.89,31.42 46.11,31.42
  Bottom 0.406: U$7.2 17.89,8.78 JP5.1 22.61,8.78 JP6.1 | 72.39,6.17 D10.GND | FB2.2 19.23,48.24 17.14,46.15 2.96,46.15 U$1.GND_MIC 2.04,45.88 0.7,47.22 0.7,48.34 1.75,49.39 3.32,49.39 3.59,49.66 3.59,49.81 C23.1 | IC2.9 46.37,27.45 46.37,28.37 46.37,31.16 46.11,31.42 48.54,31.42 50.89,33.77 52.75,33.77 53.02,34.04 53.02,34.18 R27.2 | D3.GND 32.35,55.35 33.31,56.31 35.34,56.31 36.3,55.35 36.63,55.35 5VG.TP 38.53,53.95 v39.24,54.66 | C24.1 9.13,31.24 C21.1 | C26.1 6.68,11.75 D13.GND | 7.88,19.87 14.03,19.87 16.08,21.92 20.07,21.92 20.33,22.19 20.33,23.87 20.07,24.14 19.92,24.14 C17.1 | v44.32,9.45 45.47,9.45 v47.5,7.42 | JP1.11 70.72,29.99 C11.2
  Bottom 0.457: Q2.3 Q2.2 | Q1.2 Q1.3 56.72,35.95
  Bottom 0.508: Q2.2 Q2.1 62.34,36.9 64.17,35.07 JP1.9 65.95,34.98 62.7,34.98 58.31,30.58 57.36,30.58 56.69,31.25 56.69,32.09 55.92,32.86 | R27.2 55.92,32.86 | Q1.2 Q1.1 | 55.92,32.86 55.92,35.15 56.72,35.95
  Bottom 0.635: C29.1 12.72,48.9 12.72,48.6 12.38,48.26 10.61,48.26 9.29,49.58 C28.1 8.53,48.9 8.53,48.6 8.19,48.26 6.42,48.26 6.08,48.6 6.08,48.89 C23.1 4.58,50.8 U$1.G
  Bottom 0.889: 74.93,55.09 74.59,55.09 73.39,56.29 D4.GND | 89.07,46.67 89.07,44.44 90.27,43.24 D6.GND 88.57,36.31 C15.1 86.98,35.66 86.63,35.66 84.81,33.83 D7.GND 84.8,23.93 81.28,23.93 | D8.GND 90.27,47.87 89.07,46.67 | JP4.2 75.69,23.41 76.2,23.93 81.28,23.93 | J4.4 90.81,12.24 VBAT1.TP | D9.GND 85.97,5.33 84.44,3.81 84.44,2.18 84.85,1.78 87.08,1.78 87.49,2.19 J4.6 | 72.39,6.17 73.81,6.17 75.01,7.37 81.93,7.37 83.12,6.17 D9.GND | D11.GND 54.03,20.21 S1.1 | U$7.2 11.68,8.6 D13.GND 6.68,15.67 7.88,16.87 7.88,19.87 7.76,19.99 C16.1 7.74,22.13 C5.2 5.28,26.81 D1.GND 8.06,31.24 C21.1 | SDAG.TP 74.3,50.09 74.3,54.45 74.93,55.09 | D10.GND 73.21,7.65 C12.1 | C13.1 85.97,6.22 D9.GND | 81.28,23.93 82.17,23.04 C14.1 | 74.93,55.09 77.89,55.09 77.95,55.03 78.44,55.03 C20.1 82.5,54.47 D5.GND 85.79,54.46 C19.1 86.18,53.26 86.18,49.34 86.59,48.93 87.08,48.93 C18.1 89.07,46.94 89.07,46.67 | C1.2 52.23,31.17 52.23,30.69 54.03,28.89 S1.1 | U$1.GND_MIC U$1.GND | D3.GND 27.57,55.35 C22.1 | S1.1 66.94,14.91 C27.1
  Bottom 1.27: J4.2 93.25,16.04 94.96,14.33 94.96,12.91 93.25,11.19 J4.4 93.25,8.42 94.96,6.71 94.96,5.29 93.25,3.57 J4.6 | D2.GND 11,56.48 11,56.73 U$1.INGND1 U$1.INGND2 16.04,59.21 17.82,60.99 19.29,60.99 20.33,59.95 20.33,57.43 U$1.OUTGND 21.12,56.67 22.9,54.89 24.37,54.89 24.83,55.35 26.27,55.35 C22.1 | JP1.9 66.93,35.96 67.49,35.96 72.9,41.37 72.9,47.68 SDAG.TP 70.87,48.19 69.85,49.2 69.85,50.34 67.35,52.85 JP1.2 | U$1.GND 2.04,36.24 3.47,34.81 3.47,30.27 D1.GND | C27.1 C25.1 76.01,21.35 JP4.2
  pour Bottom: -1.27,63.3 99.06,63.3 99.06,-1.47 -1.27,-1.47
  pour Top: -2.54,35.36 38.1,35.36 38.1,64.57 99.06,64.57 99.06,-1.47 -2.54,-1.47
  pour Top: -2.54,36.63 16.51,36.63 16.51,53.14 36.83,53.14 36.83,64.57 -2.54,64.57
HYD_COM1
  Bottom 0.406: J2.3 48.44,57.54 HYD_COM1.TP 53.12,48.38 K1.3
HYD_COM2
  Bottom 0.406: J2.4 52.25,57.54 HYD_COM2.TP 56.05,49.26 57.32,49.26 58.33,48.25 K2.3
HYD_RX_IN1
  Bottom 0.406: R6.1 25.7,41.89 C8.1 25.55,41.89 28.21,39.22 37.56,39.22 40.96,35.82 41.84,35.82 42.47,36.44 42.47,39.52 47.49,44.54 51.59,44.54 K1.2
HYD_RX_INPUT  (via drill 0.45)
  Top 0.406: v25.78,48.44 25.4,48.06 v23.02,48.06
  Bottom 0.406: U1.4 27.77,47.26 | 27.77,47.26 31.2,43.83 34.95,43.83 36.51,45.39 40.26,45.39 40.64,45.77 | 40.64,45.77 41.47,46.6 R12.2 | R12.1 43.02,45.77 40.64,45.77 | U$1.MIC 2.68,47.14 15.6,47.14 18.36,49.91 HYD_RX_AMP.TP 21.77,49.91 22.73,48.95 22.73,48.35 v23.02,48.06 | 26.4,48.62 C9.1 | 27.77,47.26 26.4,48.62 | v25.78,48.44 26.22,48.44 26.4,48.62
HYD_TX_OUT1
  Top 0.203: IC3.6 56.36,14.75 56.59,14.99 56.59,15.56 57.12,16.09 57.12,19 55.16,20.96 55.16,26.42 55.87,27.13 55.87,47.01 53.22,49.66 K1.4
HYD_TX_OUT2  (via drill 0.45)
  Top 0.203: IC3.7 54.96,15.66 55.29,15.99 56.52,15.99 56.77,16.24 56.77,18.85 54.8,20.81 54.8,26.57 55.37,27.14 55.37,39.15 55.51,39.29 55.51,44.87 v54.99,45.39
  Bottom 0.203: v54.99,45.39 56,46.4 56,46.43 56.92,47.35 62.36,47.35 62.89,47.88 62.89,48.63 61.98,49.53 K2.4
HYD_TX_SIG  (via drill 0.45)
  Top 0.203: IC3.3 54.96,12.53 55.17,12.32 HYD_TX_SIG.TP 58.98,12.32 v59.05,12.24
  Bottom 0.203: v59.05,12.24 58.72,11.91 54.38,11.91 51.38,14.9 51.38,16.6 48.38,19.6 46.44,19.6 44.04,17.2 44.04,15.8 43.56,15.32 38.23,15.32 37.88,15.68 37.88,21.61 32.64,26.85 32.64,28.11 30.09,30.66 26.29,30.66 24.14,32.82 17,32.82 U$1.3
IMU_CLK1
  Bottom 0.203: U8.27 13.3,23.88 Y1.1 11.53,22.1 C16.2
IMU_CLK2
  Bottom 0.203: U8.26 13.8,24.09 15.24,22.66 15.24,22.92 Y1.2 19.04,23.12 C17.2
LED_BRIDGE
  Bottom 0.889: D8.DO 93.47,42.36 D6.DI
LED_DIN
  Bottom 0.406: U$1.2 9.66,35.43 R13.1
LED_DOUT  (via drill 0.35)
  Top 0.406: J3.5 40.92,7.57 v41.27,7.93
  Bottom 0.406: v41.27,7.93 41.27,10.72 45.72,15.17 45.72,17.06 D11.DO
N$1
  Top 0.406: R1.1 38.96,10.38 IC1.3
N$2
  Bottom 0.406: TPA_R+.TP 11.73,11.67 11.61,11.79 11.61,16.76 13.01,18.16 14.05,18.16 JP12.1
N$3
  Bottom 0.406: TPA_R-.TP 18.47,18.01 JP13.1
N$4
  Bottom 0.889: D6.DO 88.01,30.6 D7.DI
N$5
  Bottom 0.203: JP8.2 50.98,28.07 51.4,28.07 51.61,27.86 51.61,26.91 51.4,26.7 48.8,26.7 48.46,27.03 IC2.3
N$6
  Bottom 0.305: Q2.4 59.7,36.69 R14.2
N$7
  Top 0.203: C2.1 49.59,14.77 50.66,15.83 52.37,15.83 52.52,15.68 52.52,15.04 52.8,14.75 IC3.10
N$8  (via drill 0.45)
  Top 0.406: v5.08,16.31 5.08,26.47 v12.7,34.09
  Bottom 0.406: D13.DI 3.48,14.71 v5.08,16.31 | v12.7,34.09 R13.2
N$9
  Bottom 0.406: JP5.2 16.76,5.7 U$7.4
N$10  (via drill 0.45)
  Top 0.203: v9.14,54.92 8.33,54.1 6.61,54.1 5.88,53.37 5.88,52.34 11.43,46.79 v11.43,44.25
  Bottom 0.203: D2.DI 9.11,54.88 v9.14,54.92 | v11.43,44.25 5.83,38.65 5.83,37.1 5.28,36.56 D1.DO
N$12
  Top 0.203: IC3.1 53.07,13.3 R4.2 51.68,11.75 52.7,10.8 55.24,10.8 55.5,10.97 59.31,10.97 60.1,11.76 60.1,20.6 56.98,23.72 IC4.2
N$13
  Top 0.203: IC3.2 54.56,12.7 53.77,11.91 | R5.1 54.16,11.33 59.16,11.33 59.74,11.91 59.74,18.87 56.98,21.63 IC4.1
  Top 0.305: 53.77,11.91 R5.1
N$15
  Bottom 0.406: FB3.2 33.26,41.63 JP14.2
N$16
  Bottom 0.406: C7.1 28.05,41.43 R6.2 29.15,40.33 R7.1
N$17
  Bottom 0.406: R9.2 23.26,44.24 23.62,44.6 23.62,45.52 24.06,45.96 U1.1 | R9.2 22.07,44.14 R10.1 | R9.2 22.09,44.15 C8.2
N$18
  Bottom 0.406: D1.DI 2.08,22.86 6.19,18.76 D13.DO
N$19
  Bottom 0.406: U1.3 24.55,47.26 24.26,47.55 24.26,49.52 C9.2 25.29,50.55 25.29,50.7 25.56,50.97 27.24,50.97 27.51,50.7 27.51,50.61 R11.1 29.13,48.99 29.13,48.85 30.47,47.51 R8.2
N$20
  Bottom 0.406: R8.1 33.64,46.2 C10.1
N$21
  Bottom 0.406: R11.2 31.34,48.68 33.21,48.68 35.13,46.76 R12.3
N$24  (via drill 0.45)
  Top 1.27: J4.3 90.17,16.69 90.17,26.47 87.63,29.01 83.82,29.01 76.2,36.63 v76.2,48.06 | v76.2,48.06 v76.2,49.33 v77.47,49.33 v77.47,48.06 v76.2,48.06
  Bottom 1.27: v76.2,49.33 76.2,52.77 D12.2 | v76.2,49.33 v76.2,48.06 v77.47,48.06 v77.47,49.33 v76.2,49.33
N$25  (via drill 0.45)
  Top 0.305: v9.65,57.96 12.19,60.5 v26.67,60.5
  Bottom 0.305: D2.DO 9.65,58.69 v9.65,57.96 | v26.67,60.5 27.3,59.87 27.85,59.87 D3.DI
N$26  (via drill 0.45)
  Top 0.305: v40.26,50.98 43.56,50.98 v43.81,50.73
  Bottom 0.305: v40.26,50.98 38.33,52.91 37.59,52.91 35.15,55.35 D3.DO | v43.81,50.73 47.03,53.94 47.03,58.23 47.75,58.95 60.2,58.95 60.93,58.22 63.63,58.22 65.28,56.57 67.63,56.57 D4.DI
N$27
  Bottom 0.889: D5.DI 83.3,59.31 82.43,58.45 77.86,58.45 D4.DO
N$28
  Bottom 0.889: D8.DI 89.29,54.89 D5.DO
N$29
  Bottom 0.889: D7.DO 84.81,9.64 87.49,6.96 87.49,5.38 85.97,3.86 D9.DI
N$30
  Bottom 0.406: D10.DI 74.94,6.17 D9.DO
N$31  (via drill 0.35)
  Top 0.406: v69.09,8.05 62.48,8.05 61.72,8.82 v61.59,8.82
  Bottom 0.406: D10.DO 68.47,8.05 v69.09,8.05 | v61.59,8.82 60.71,9.7 60.71,11.56 59.76,12.5 59.76,12.54 59.35,12.95 58.76,12.95 58.17,12.36 55.75,12.36 D11.DI
N$32
  Bottom 0.406: JP6.2 24.26,2.7 U$7.7
N$37
  Bottom 0.203: U8.9 13.8,30.19 12.75,31.24 C21.2
N$40
  Bottom 0.203: R32.1 10.15,27.81 U8.4
N$81
  Bottom 0.508: Q1.4 54.74,36.84 R23.2
N$82  (via drill 0.45)
  Top 0.406: LED2.A 39.36,57.84 39.36,56.7 45.72,50.34 45.72,39.8 v49.66,35.87
  Bottom 0.406: R29.1 50.25,35.87 v49.66,35.87
PAM_CN1  (via drill 0.45)
  Top 0.203: C4.2 55.76,18.97 v55.5,19.23 | IC3.4 56.2,13.95 56.52,13.64 v56.52,13.13
  Bottom 0.203: v55.5,19.23 56.52,18.21 v56.52,13.13
PAM_CN2
  Top 0.203: C6.2 52.96,18.27 52.96,18.36 53.11,18.51 54.62,18.51 54.77,18.36 54.77,16.65 54.56,16.44 IC3.8
PAM_CP1
  Top 0.203: IC3.9 54.16,17.21 C4.1
PAM_CP2
  Top 0.203: IC3.11 52.09,14.35 C6.1
PB1K_EN
  Top 0.889: JP4.4 71.69,22.76 71.69,23.05 72.54,23.9 78.83,23.9 79.69,23.05 79.69,19.56 J4.5
  Bottom 0.889: S1.2 64.06,23.09 64.06,20.31 64.92,19.46 68.67,19.46 69.53,20.31 69.53,20.6 JP4.4
SCL_3V  (via drill 0.35, 0.45)
  Top 0.254: v30.23,14.78 31.24,13.77 34.04,13.77 37.8,17.54 43.08,17.54
  Top 0.305: JP3.2 45.16,24.36 44.45,25.07 v43.05,25.07
  Top 0.406: 44.07,18.53 Q4.2 | 44.07,18.53 45.06,17.54 46.35,17.54 46.56,17.75 46.56,19.31 45.83,20.04 R3.1 45.83,21.98 45.16,22.65 JP3.2 | 43.08,17.54 44.07,18.53
  Bottom 0.203: IC2.7 43.86,27.53 SCL_3V.TP | v30.23,14.78 28.47,16.54 28.47,19.67 21.34,26.81 U8.19
  Bottom 0.305: SCL_3V.TP 43.23,25.25 v43.05,25.07
  Bottom 0.406: U$7.8 26.92,11.48 v30.23,14.78
SCL_5V  (via drill 0.45)
  Top 0.406: IC1.6 44.9,11.68 | 44.9,11.68 45.96,12.74 R18.1 45.96,15.32 Q4.3 43.91,16.53 v43.43,16.05 | 44.9,11.68 44.9,11.25 45.24,10.91 45.24,4.51 J3.4
  Bottom 0.406: SCL_5V.TP 43.43,20.47 v43.43,16.05
SDA_3V  (via drill 0.35, 0.45)
  Top 0.203: v22.99,26.47 22.72,26.2 v20.7,26.2 | v42.24,27.87 40.68,26.31 40.26,26.31 39.45,25.5 JP2.2
  Top 0.406: JP2.2 39.45,21.12 R2.1 39.89,18.81 Q3.2 37.61,18.53 33.86,14.78 v31.62,14.78
  Bottom 0.203: IC2.8 43.67,28.03 SDA_3V.TP 42.95,28.58 v42.24,27.87 | U8.20 17.56,26 18.02,26.46 20.45,26.46 v20.7,26.2 | v31.62,14.78 28.83,17.58 28.83,19.82 22.99,25.66 v22.99,26.47
  Bottom 0.406: U$7.9 29.46,12.63 v31.62,14.78
SDA_5V  (via drill 0.45)
  Top 0.406: IC1.4 43.83,10.08 42.52,8.78 | 42.52,8.78 42.2,9.1 35.93,9.1 35.93,12.54 37.84,14.45 R17.1 40.56,15 Q3.3 39.08,16.53 v38.48,15.93 | 42.52,8.78 42.55,8.75 42.55,3.35 43.56,2.34 46.88,2.34 J3.3
  Bottom 0.406: v38.48,15.93 38.48,23.88 36.04,26.32 36.04,27.23 37.16,28.34 SDA_5V.TP
TPA_L+  (via drill 0.45)
  Top 0.305: U$1.OUTL 25.69,54.61 35.79,54.61 36.82,53.59 36.82,45.24 37.81,44.25 39.8,44.25 46.86,37.19 v46.86,35.1 | v22.35,7.55 24.13,9.32 24.13,15.5 24.61,15.97 24.61,16.9 24.59,16.92 24.59,31.51 26.27,33.2 28.19,33.2 v29.46,34.47
  Bottom 0.305: U$7.6 21.84,7.04 v22.35,7.55 | v46.86,35.1 46.79,35.1 44.55,32.87 35.2,32.87 33.22,34.85 29.84,34.85 v29.46,34.47
TPA_R+  (via drill 0.45)
  Top 0.305: U$1.OUTR 21.07,54.15 35.6,54.15 36.36,53.4 36.36,45.05 37.76,43.65 38.82,43.65 42.34,40.13 42.65,39.83 43.58,39.83 45.21,38.19 v45.21,35.36 | v21.21,7.67 23.67,10.14 23.67,15.68 24.15,16.16 24.15,16.71 24.13,16.73 24.13,31.7 26.08,33.66 27.38,33.66 v28.32,34.6
  Bottom 0.305: U$7.5 19.3,5.77 v21.21,7.67 | v45.21,35.36 44.96,35.1 44.96,33.92 44.36,33.33 35.39,33.33 33.36,35.36 29.08,35.36 v28.32,34.6
TXRX_OUT1
  Bottom 0.305: Q1.6 Q1.5 56.07,40.47 56.07,40.5 56.01,40.57 56.39,40.57 | Q1.6 Q1.7 | Q1.7 Q1.8 58.02,40.33 57.78,40.57 57.02,40.57 | Q1.7 57.37,40.22 57.02,40.57 | 57.02,40.57 56.39,40.57 | Q1.6 56.72,40.23 56.39,40.57
  Bottom 0.406: 56.07,40.47 55.59,40.47 55.24,40.82 50.42,40.82 49.53,41.71 48.9,41.71 48.14,42.46 K1.8
TXRX_OUT2
  Bottom 0.305: Q2.5 Q2.6 Q2.7 Q2.8
  Bottom 0.406: Q2.5 59.91,40.35 59.75,40.5 59.56,40.69 | Q2.6 60.56,40.46 60.33,40.69 | 60.33,40.69 59.56,40.69 | Q2.7 61.21,40.44 60.96,40.69 | 60.96,40.69 60.33,40.69 | Q2.8 61.86,40.56 61.72,40.69 60.96,40.69 | 59.56,40.69 57.4,42.85 K2.8
TXRX_RELAY
  Bottom 0.406: R14.1 57.8,35.41 58.73,36.34 58.73,40.34 57.36,41.71 50.83,41.71 48.56,43.99 47.72,43.99 47.13,43.4 47.13,41.3 48.97,39.46 48.97,38.46 49.59,37.83 50.99,39.23 R29.2 | U$1.4 19.04,33.33 32,33.33 32.64,32.69 34.66,32.69 34.99,32.36 44.76,32.36 46.73,34.33 51.26,34.33 R27.1
  Bottom 0.508: R27.1 52.65,35.72 52.65,35.94 53,36.28 53,38.19 | 53,38.19 53.29,38.49 53.51,38.49 R23.1 | R29.2 52.46,38.49 52.67,38.49 52.97,38.19 53,38.19
  Bottom 0.889: R14.1 57.8,31.76 TP_TXRX.TP
VBAT
  Top 1.27: J4.1 93.25,19.85 94.96,18.14 94.96,12.91 93.96,11.9 92.54,11.9 88.75,15.69 88.75,16.46 72.68,32.53 JP1.10
  Bottom 0.203: IC2.2 48.47,27.53 48.64,27.36 50.6,27.36 JP8.3
  Bottom 0.406: JP8.3 50.01,27.38 49.15,28.25 49.53,28.63 49.53,31.62 50.84,32.93 52.52,32.93 52.79,32.67 52.79,32.52 C1.1 | JP1.10 70.08,32.53 C11.1
  Bottom 0.889: J4.1 93.25,20.76 VBAT.TP | JP1.10 65.24,31.73 62.26,31.73 60.04,29.5 56.14,29.5 53.92,31.73 C1.1
VOL_POT_SIG
  Bottom 0.305: U$1.14 33.23,52.86 34.53,54.15 35.6,54.15 39.43,50.32 40.53,50.32 41.11,50.9 42.21,50.9
  Bottom 0.406: J2.1 40.64,52.48 42.21,50.9 45.25,47.86 45.25,45.66 41.4,41.81 VR1.2

## Text on the board
tPlace: VBUS | TXRX> | GND | VOLP | VOL+ | HYD+ | HYD- | BONE+ | BONE- | THM | ISET | RXGain / Adj | CE | PGOOD | CHG | BQ24074 / Charger Controller | OUT | GND | OnOffButton | VBAT | VolumePot | GND | SDASEL / 1(A) 0 | SCLSEL / 1(A) 0 | Designed by Aaron Becker, Nov 2024 | VBAT+ | IN+ | EN | GND | GND | LB | 5V+ | GND | Green Team | WCHG | HSIG | GND | TPA2016 / Audio Amplifier | PowerBoost 1000 / Boost Converter | GND | DOUT | SCL5 | SDA5 | 5V+ | GND | GNDBridge | PB_EN | GND | R- | L+ | SCL | 3.3V | 5V | SHDN | R+ | L- | SDA | GND
bPlace: 5V | 3.3V | <HYD_COM1 | HYD_COM2> | GND | powered by magik and caffeine | <GND | TXRX> / SIG | SDA5V | SDA3V | 3.3 | VB | SCL5V | SCL3V | MCPWR | We got an underwater message!! / But... it doesn't seem quite right... | L+ | What came through?? | VBAT | L- | It says: "you forgot to write / in your lab notebook AGAIN" / / https://xkcd.com/1457/ | R+ | GND | R- | RBrg | LBrg